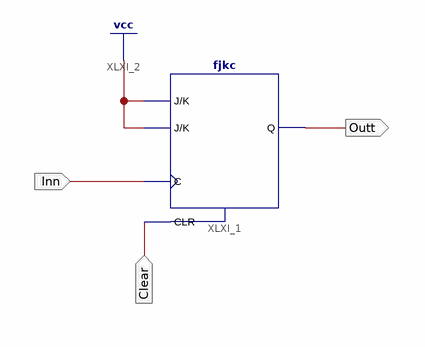
[diagram p0: schematic sheet 1]
// Xilinx ISE schematic Div2.sch (spartan6) as structural Verilog: 1 symbols, 3 ports
module Div2 (
  input  Inn,
  input  Clear,
  output Outt
);

  fjkc XLXI_1 (.C(Inn), .CLR(Clear), .J(1'b1), .K(1'b1), .Q(Outt));
endmodule
